# Altium schematic sheet LMR50410.SchDoc: 10V Buck
size A4; Author: Chawthri K.; Organization: Waterloop; Address1: 200 University Ave W; Address2: Engineering 5, 1104; Address3: Waterloo, ON; Address4: N2L 3G1; Revision: 0; SheetNumber: 1; SheetTotal: 1
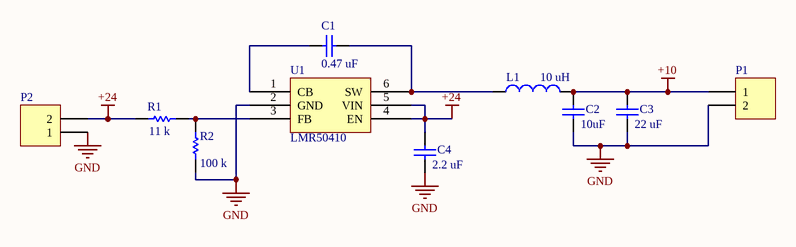
[diagram p0: LMR50410.SchDoc]

## Parts
C1  value 0.47 uF  [0805 - Capacitor]  (hidden comment: Capacitor - Nonpolarized)
C2  value 10uF  [0805 - Capacitor]  (hidden comment: Capacitor - Nonpolarized)
C3  value 22 uF  [0805 - Capacitor]  (hidden comment: Capacitor - Nonpolarized)
C4  value 2.2 uF  [0805 - Capacitor]  (hidden comment: Capacitor - Nonpolarized)
L1  value 10 uH  [PA4340 - Inductor]  (hidden comment: Inductor)
P1  1x2 Header  [HDR1X2]  (value not drawn)
P2  1x2 Header  [HDR1X2]  (value not drawn)
R1  value 11 k  [0603 - Resistor]  (hidden comment: Resistor)
R2  value 100 k  [0603 - Resistor]  (hidden comment: Resistor)
U1  LMR50410  [LMR50410]

## Nets
+10: C2.2 C3.2 L1.2 P1.1
+24: C4.2 P2.2 R1.1 U1.4(EN) U1.5(VIN)
GND: C2.1 C3.1 C4.1 P1.2 P2.1 R2.1 U1.2(GND)
NetC1_1: C1.1 L1.1 U1.6(SW)
NetC1_2: C1.2 U1.1(CB)
NetR1_2: R1.2 R2.2 U1.3(FB)

## Notes on the sheet
- Title:
- Size:
- Date:
- A4
- Author:
- Revision:
- Sheet
- of
- File:

## Library data of the parts
C1-C4 = Capacitor - Nonpolarized: Nonpolarized Capacitor; Manufacturer: Yageo; Manufacturer Part Number: CC0805KKX5R8BB106; Supplier Part Number: 311-1869-1-ND; Supplier: *; Rating: *
L1 = Inductor: Manufacturer Part Number: PA4340.103NLT; Manufacturer: Pulse; Rating: *; Supplier Part Number: 553-2987-1-ND; Supplier: *
P1 P2 = 1x2 Header: 1x2 Pin Header
R1 = Resistor: Manufacturer Part Number: ESR03EZPJ113; Manufacturer: ROHM; Rating: *; Supplier Part Number: RHM11KDCT-ND; Supplier: *
R2 = Resistor: Manufacturer Part Number: ESR03EZPJ104; Manufacturer: ROHM; Rating: *; Supplier Part Number: RHM100KDCT-ND; Supplier: *
U1 = LMR50410: 4V to 36V 1A, Buck Converter; Manufacturer: Texas Instruments; Manufacturer Part Number: LMR50410YQDBVRQ1; Datasheet: https://www.ti.com/lit/ds/symlink/lmr50410-q1.pdf; Digikey Part Number: 296-LMR50410YQDBVRQ1CT-ND